# Altium schematic sheet relay isolation circuit.SchDoc
size D; SheetNumber: 2; SheetTotal: 3; SPICEModelCachePQJRNVQB: <root> / <DocumentId>PQJRNVQB</DocumentId> / </root>
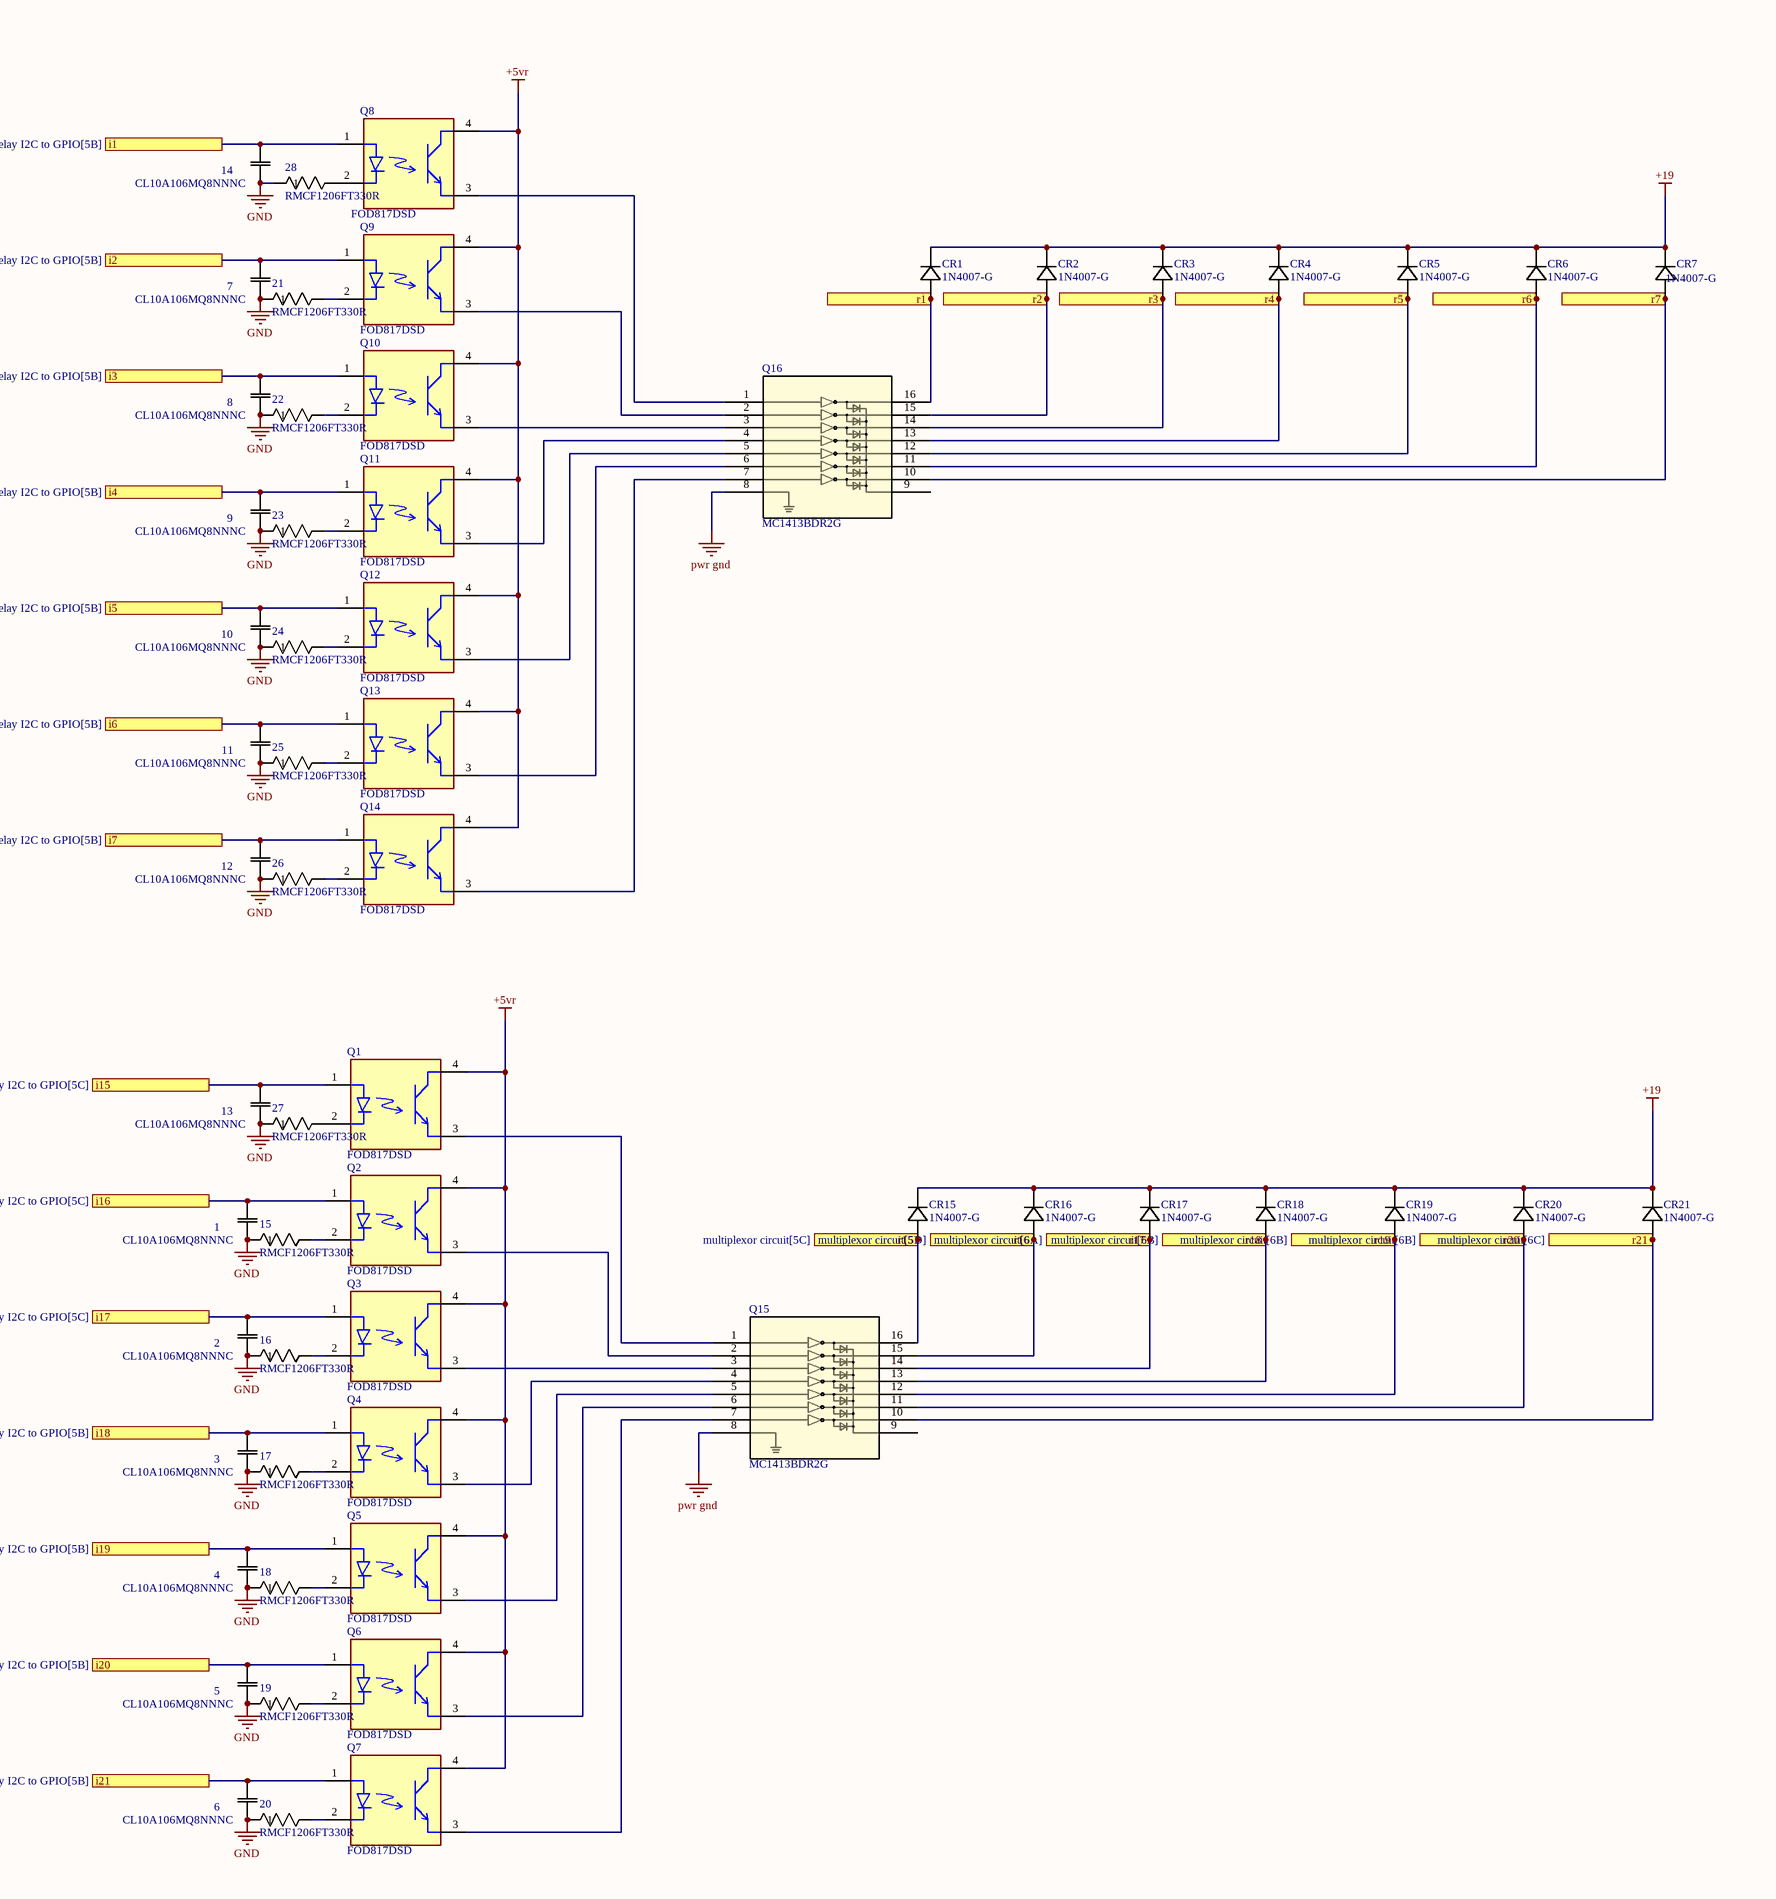
[diagram p0: relay isolation circuit.SchDoc, left]
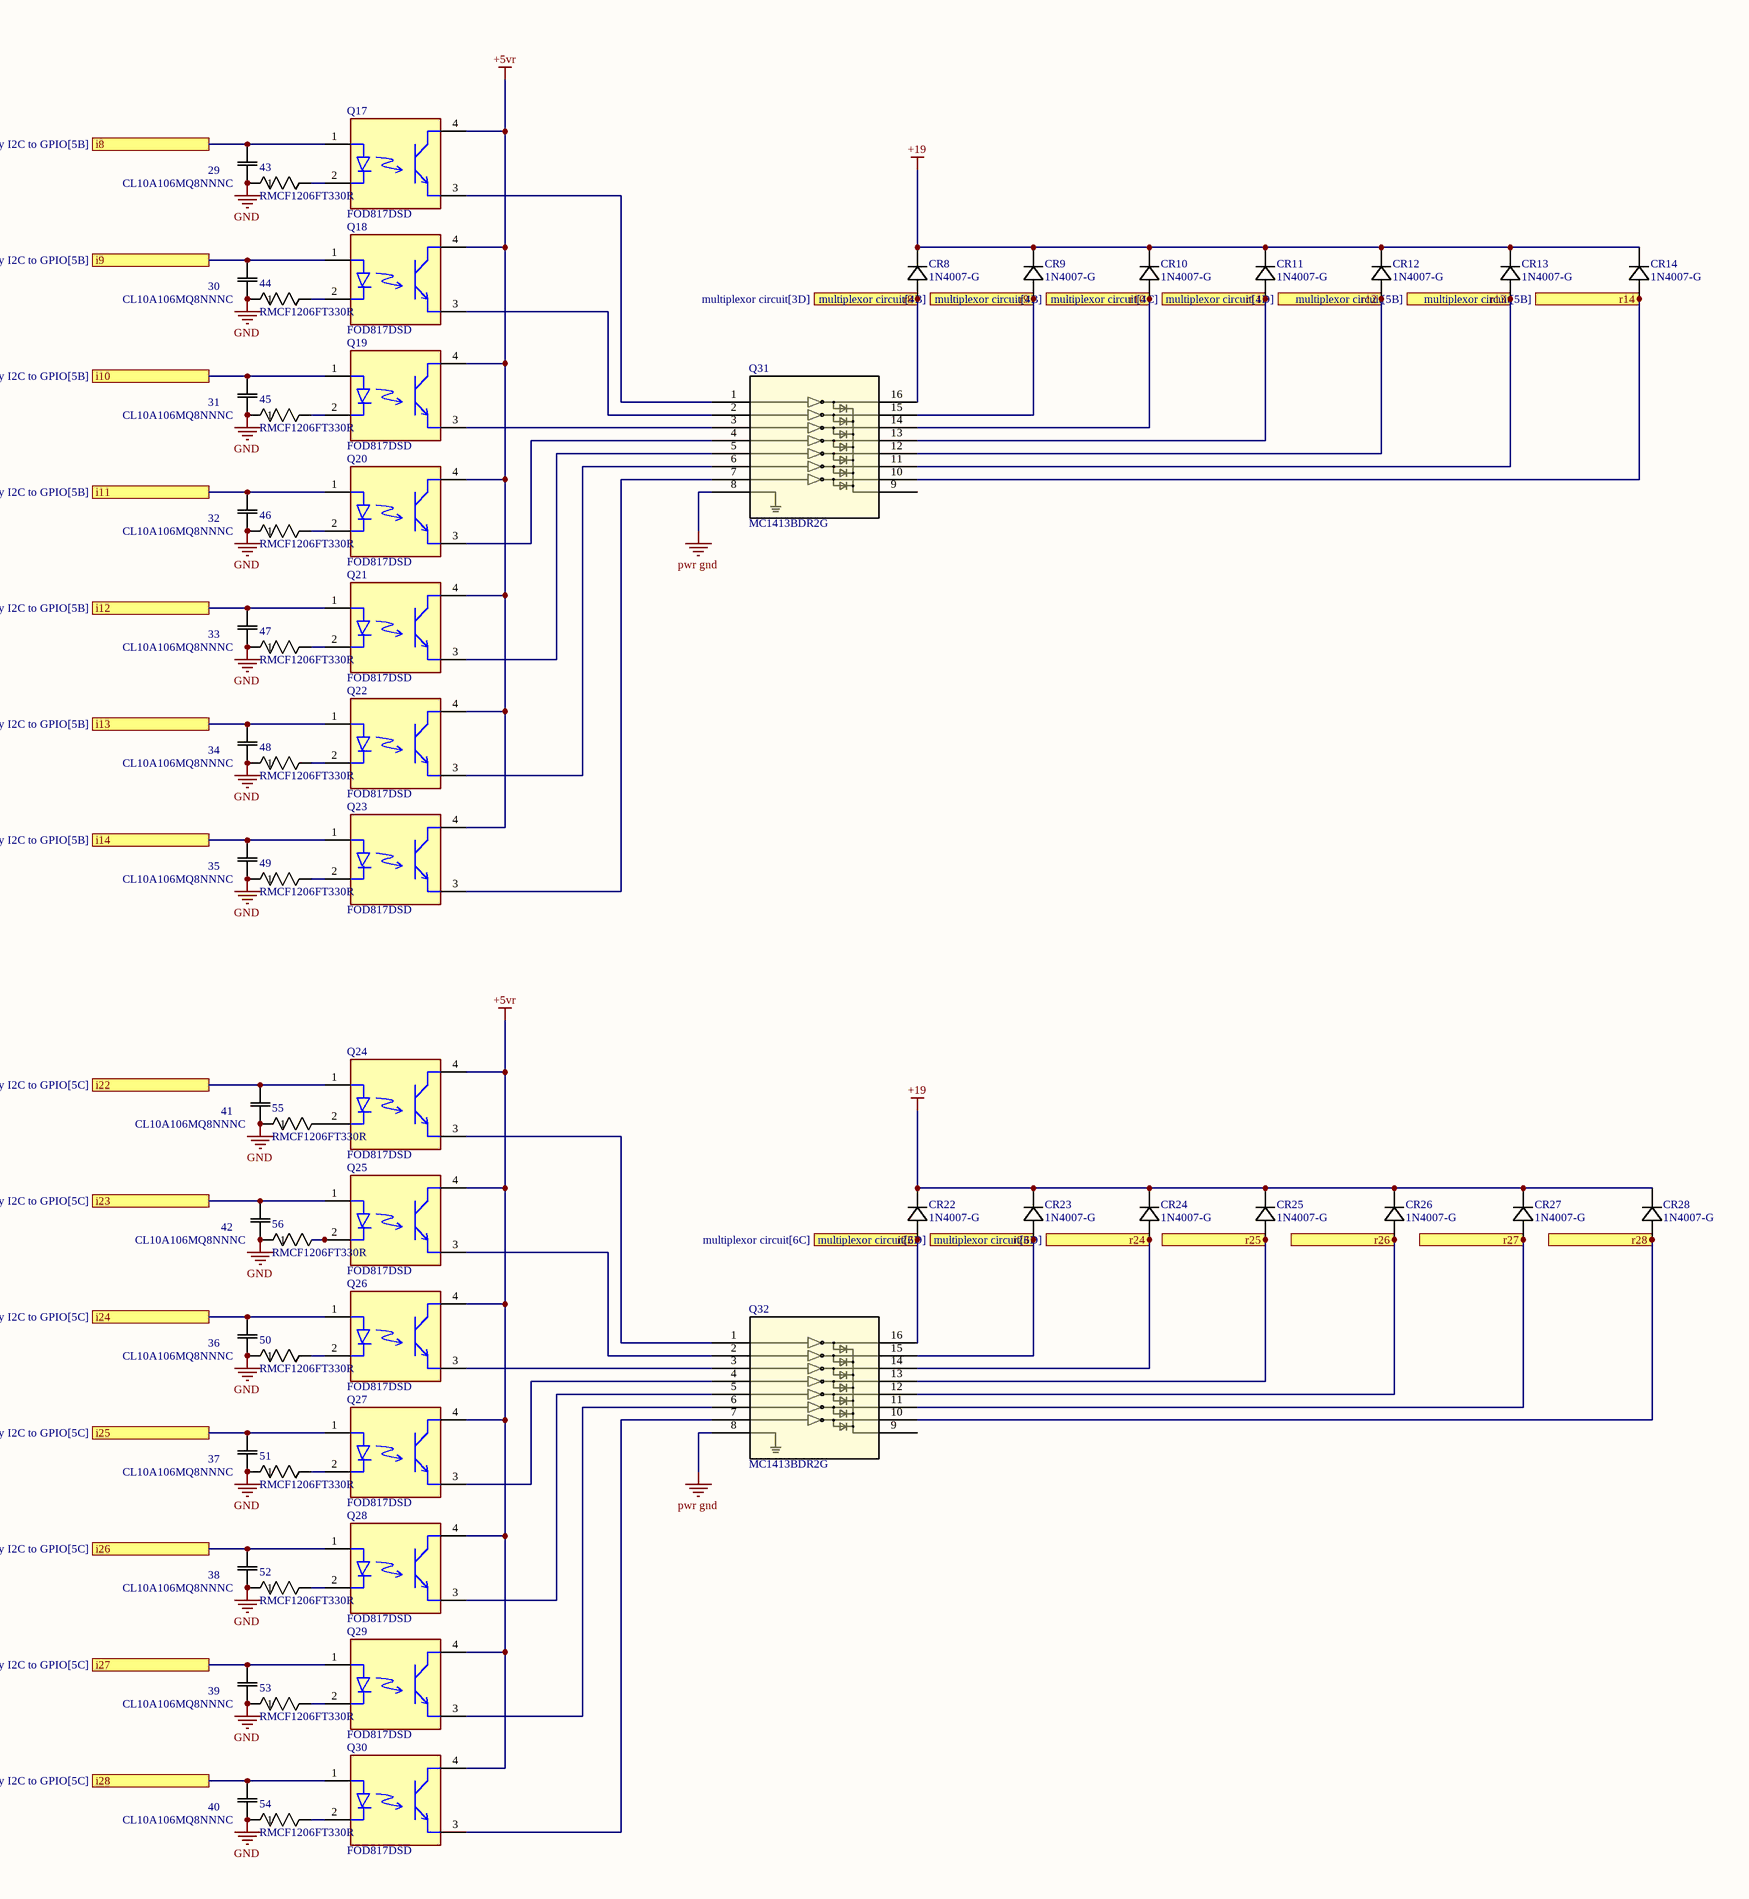
[diagram p1: relay isolation circuit.SchDoc, right]

## Parts
1  CL10A106MQ8NNNC  [CAP_CL10_SAM]
2  CL10A106MQ8NNNC  [CAP_CL10_SAM]
3  CL10A106MQ8NNNC  [CAP_CL10_SAM]
4  CL10A106MQ8NNNC  [CAP_CL10_SAM]
5  CL10A106MQ8NNNC  [CAP_CL10_SAM]
6  CL10A106MQ8NNNC  [CAP_CL10_SAM]
7  CL10A106MQ8NNNC  [CAP_CL10_SAM]
8  CL10A106MQ8NNNC  [CAP_CL10_SAM]
9  CL10A106MQ8NNNC  [CAP_CL10_SAM]
10  CL10A106MQ8NNNC  [CAP_CL10_SAM]
11  CL10A106MQ8NNNC  [CAP_CL10_SAM]
12  CL10A106MQ8NNNC  [CAP_CL10_SAM]
13  CL10A106MQ8NNNC  [CAP_CL10_SAM]
14  CL10A106MQ8NNNC  [CAP_CL10_SAM]
15  RMCF1206FT330R  [STA_RMCF1206_STP]
16  RMCF1206FT330R  [STA_RMCF1206_STP]
17  RMCF1206FT330R  [STA_RMCF1206_STP]
18  RMCF1206FT330R  [STA_RMCF1206_STP]
19  RMCF1206FT330R  [STA_RMCF1206_STP]
20  RMCF1206FT330R  [STA_RMCF1206_STP]
21  RMCF1206FT330R  [STA_RMCF1206_STP]
22  RMCF1206FT330R  [STA_RMCF1206_STP]
23  RMCF1206FT330R  [STA_RMCF1206_STP]
24  RMCF1206FT330R  [STA_RMCF1206_STP]
25  RMCF1206FT330R  [STA_RMCF1206_STP]
26  RMCF1206FT330R  [STA_RMCF1206_STP]
27  RMCF1206FT330R  [STA_RMCF1206_STP]
28  RMCF1206FT330R  [STA_RMCF1206_STP]
29  CL10A106MQ8NNNC  [CAP_CL10_SAM]
30  CL10A106MQ8NNNC  [CAP_CL10_SAM]
31  CL10A106MQ8NNNC  [CAP_CL10_SAM]
32  CL10A106MQ8NNNC  [CAP_CL10_SAM]
33  CL10A106MQ8NNNC  [CAP_CL10_SAM]
34  CL10A106MQ8NNNC  [CAP_CL10_SAM]
35  CL10A106MQ8NNNC  [CAP_CL10_SAM]
36  CL10A106MQ8NNNC  [CAP_CL10_SAM]
37  CL10A106MQ8NNNC  [CAP_CL10_SAM]
38  CL10A106MQ8NNNC  [CAP_CL10_SAM]
39  CL10A106MQ8NNNC  [CAP_CL10_SAM]
40  CL10A106MQ8NNNC  [CAP_CL10_SAM]
41  CL10A106MQ8NNNC  [CAP_CL10_SAM]
42  CL10A106MQ8NNNC  [CAP_CL10_SAM]
43  RMCF1206FT330R  [STA_RMCF1206_STP]
44  RMCF1206FT330R  [STA_RMCF1206_STP]
45  RMCF1206FT330R  [STA_RMCF1206_STP]
46  RMCF1206FT330R  [STA_RMCF1206_STP]
47  RMCF1206FT330R  [STA_RMCF1206_STP]
48  RMCF1206FT330R  [STA_RMCF1206_STP]
49  RMCF1206FT330R  [STA_RMCF1206_STP]
50  RMCF1206FT330R  [STA_RMCF1206_STP]
51  RMCF1206FT330R  [STA_RMCF1206_STP]
52  RMCF1206FT330R  [STA_RMCF1206_STP]
53  RMCF1206FT330R  [STA_RMCF1206_STP]
54  RMCF1206FT330R  [STA_RMCF1206_STP]
55  RMCF1206FT330R  [STA_RMCF1206_STP]
56  RMCF1206FT330R  [STA_RMCF1206_STP]
CR1  1N4007-G  [1N4-G]
CR2  1N4007-G  [1N4-G]
CR3  1N4007-G  [1N4-G]
CR4  1N4007-G  [1N4-G]
CR5  1N4007-G  [1N4-G]
CR6  1N4007-G  [1N4-G]
CR7  1N4007-G  [1N4-G]
CR8  1N4007-G  [1N4-G]
CR9  1N4007-G  [1N4-G]
CR10  1N4007-G  [1N4-G]
CR11  1N4007-G  [1N4-G]
CR12  1N4007-G  [1N4-G]
CR13  1N4007-G  [1N4-G]
CR14  1N4007-G  [1N4-G]
CR15  1N4007-G  [1N4-G]
CR16  1N4007-G  [1N4-G]
CR17  1N4007-G  [1N4-G]
CR18  1N4007-G  [1N4-G]
CR19  1N4007-G  [1N4-G]
CR20  1N4007-G  [1N4-G]
CR21  1N4007-G  [1N4-G]
CR22  1N4007-G  [1N4-G]
CR23  1N4007-G  [1N4-G]
CR24  1N4007-G  [1N4-G]
CR25  1N4007-G  [1N4-G]
CR26  1N4007-G  [1N4-G]
CR27  1N4007-G  [1N4-G]
CR28  1N4007-G  [1N4-G]
Q1  FOD817DSD  [FP-709AH-MFG]
Q2  FOD817DSD  [FP-709AH-MFG]
Q3  FOD817DSD  [FP-709AH-MFG]
Q4  FOD817DSD  [FP-709AH-MFG]
Q5  FOD817DSD  [FP-709AH-MFG]
Q6  FOD817DSD  [FP-709AH-MFG]
Q7  FOD817DSD  [FP-709AH-MFG]
Q8  FOD817DSD  [FP-709AH-MFG]
Q9  FOD817DSD  [FP-709AH-MFG]
Q10  FOD817DSD  [FP-709AH-MFG]
Q11  FOD817DSD  [FP-709AH-MFG]
Q12  FOD817DSD  [FP-709AH-MFG]
Q13  FOD817DSD  [FP-709AH-MFG]
Q14  FOD817DSD  [FP-709AH-MFG]
Q15  MC1413BDR2G  [SOIC16_751B-05_ONS]
Q16  MC1413BDR2G  [SOIC16_751B-05_ONS]
Q17  FOD817DSD  [FP-709AH-MFG]
Q18  FOD817DSD  [FP-709AH-MFG]
Q19  FOD817DSD  [FP-709AH-MFG]
Q20  FOD817DSD  [FP-709AH-MFG]
Q21  FOD817DSD  [FP-709AH-MFG]
Q22  FOD817DSD  [FP-709AH-MFG]
Q23  FOD817DSD  [FP-709AH-MFG]
Q24  FOD817DSD  [FP-709AH-MFG]
Q25  FOD817DSD  [FP-709AH-MFG]
Q26  FOD817DSD  [FP-709AH-MFG]
Q27  FOD817DSD  [FP-709AH-MFG]
Q28  FOD817DSD  [FP-709AH-MFG]
Q29  FOD817DSD  [FP-709AH-MFG]
Q30  FOD817DSD  [FP-709AH-MFG]
Q31  MC1413BDR2G  [SOIC16_751B-05_ONS]
Q32  MC1413BDR2G  [SOIC16_751B-05_ONS]

## Ports
i1 (see Relay I2C to GPIO[5B]), i2 (see Relay I2C to GPIO[5B]), i3 (see Relay I2C to GPIO[5B]), i4 (see Relay I2C to GPIO[5B]), i5 (see Relay I2C to GPIO[5B]), i6 (see Relay I2C to GPIO[5B]), i7 (see Relay I2C to GPIO[5B]), i8 (see Relay I2C to GPIO[5B]), i9 (see Relay I2C to GPIO[5B]), i10 (see Relay I2C to GPIO[5B]), i11 (see Relay I2C to GPIO[5B]), i12 (see Relay I2C to GPIO[5B]), i13 (see Relay I2C to GPIO[5B]), i14 (see Relay I2C to GPIO[5B]), i15 (see Relay I2C to GPIO[5C]), i16 (see Relay I2C to GPIO[5C]), i17 (see Relay I2C to GPIO[5C]), i18 (see Relay I2C to GPIO[5B]), i19 (see Relay I2C to GPIO[5B]), i20 (see Relay I2C to GPIO[5B]), i21 (see Relay I2C to GPIO[5B]), i22 (see Relay I2C to GPIO[5C]), i23 (see Relay I2C to GPIO[5C]), i24 (see Relay I2C to GPIO[5C]), i25 (see Relay I2C to GPIO[5C]), i26 (see Relay I2C to GPIO[5C]), i27 (see Relay I2C to GPIO[5C]), i28 (see Relay I2C to GPIO[5C]), r1 (see multiplexor circuit[3B]), r2 (see multiplexor circuit[3B]), r3 (see multiplexor circuit[3C]), r4 (see multiplexor circuit[3D]), r5 (see multiplexor circuit[3B]), r6 (see multiplexor circuit[3C]), r7 (see multiplexor circuit[3C]), r8 (see multiplexor circuit[3D]), r9 (see multiplexor circuit[4B]), r10 (see multiplexor circuit[4B]), r11 (see multiplexor circuit[4C]), r12 (see multiplexor circuit[4D]), r13 (see multiplexor circuit[5B]), r14 (see multiplexor circuit[5B]), r15 (see multiplexor circuit[5C]), r16 (see multiplexor circuit[5D]), r17 (see multiplexor circuit[6A]), r18 (see multiplexor circuit[6B]), r19 (see multiplexor circuit[6B]), r20 (see multiplexor circuit[6B]), r21 (see multiplexor circuit[6C]), r22 (see multiplexor circuit[6C]), r23 (see multiplexor circuit[6D]), r24 (see multiplexor circuit[6D]), r25, r26, r27, r28

## Nets
+5vr: Q1.4(C) Q2.4(C) Q3.4(C) Q4.4(C) Q5.4(C) Q6.4(C) Q7.4(C) Q8.4(C) Q9.4(C) Q10.4(C) Q11.4(C) Q12.4(C) Q13.4(C) Q14.4(C) Q17.4(C) Q18.4(C) Q19.4(C) Q20.4(C) Q21.4(C) Q22.4(C) Q23.4(C) Q24.4(C) Q25.4(C) Q26.4(C) Q27.4(C) Q28.4(C) Q29.4(C) Q30.4(C)
+19: CR1.1 CR2.1 CR3.1 CR4.1 CR5.1 CR6.1 CR7.1 CR8.1 CR9.1 CR10.1 CR11.1 CR12.1 CR13.1 CR14.1 CR15.1 CR16.1 CR17.1 CR18.1 CR19.1 CR20.1 CR21.1 CR22.1 CR23.1 CR24.1 CR25.1 CR26.1 CR27.1 CR28.1
GND: 1.1 2.1 3.1 4.1 5.1 6.1 7.1 8.1 9.1 10.1 11.1 12.1 13.1 14.1 15.1 16.1 17.1 18.1 19.1 20.1 21.1 22.1 23.1 24.1 25.1 26.1 27.1 28.1 29.1 30.1 31.1 32.1 33.1 34.1 35.1 36.1 37.1 38.1 39.1 40.1 41.1 42.1 43.1 44.1 45.1 46.1 47.1 48.1 49.1 50.1 51.1 52.1 53.1 54.1 55.1 56.1
pwr gnd: Q15.8 Q16.8 Q31.8 Q32.8
i1: 14.2 Q8.1(A) ; port i1
i2: 7.2 Q9.1(A) ; port i2
i3: 8.2 Q10.1(A) ; port i3
i4: 9.2 Q11.1(A) ; port i4
i5: 10.2 Q12.1(A) ; port i5
i6: 11.2 Q13.1(A) ; port i6
i7: 12.2 Q14.1(A) ; port i7
i8: 29.2 Q17.1(A) ; port i8
i9: 30.2 Q18.1(A) ; port i9
i10: 31.2 Q19.1(A) ; port i10
i11: 32.2 Q20.1(A) ; port i11
i12: 33.2 Q21.1(A) ; port i12
i13: 34.2 Q22.1(A) ; port i13
i14: 35.2 Q23.1(A) ; port i14
i15: 13.2 Q1.1(A) ; port i15
i16: 1.2 Q2.1(A) ; port i16
i17: 2.2 Q3.1(A) ; port i17
i18: 3.2 Q4.1(A) ; port i18
i19: 4.2 Q5.1(A) ; port i19
i20: 5.2 Q6.1(A) ; port i20
i21: 6.2 Q7.1(A) ; port i21
i22: 41.2 Q24.1(A) ; port i22
i23: 42.2 Q25.1(A) ; port i23
i24: 36.2 Q26.1(A) ; port i24
i25: 37.2 Q27.1(A) ; port i25
i26: 38.2 Q28.1(A) ; port i26
i27: 39.2 Q29.1(A) ; port i27
i28: 40.2 Q30.1(A) ; port i28
r1: CR1.2 Q16.16 ; port r1
r2: CR2.2 Q16.15 ; port r2
r3: CR3.2 Q16.14 ; port r3
r4: CR4.2 Q16.13 ; port r4
r5: CR5.2 Q16.12 ; port r5
r6: CR6.2 Q16.11 ; port r6
r7: CR7.2 Q16.10 ; port r7
r8: CR8.2 Q31.16 ; port r8
r9: CR9.2 Q31.15 ; port r9
r10: CR10.2 Q31.14 ; port r10
r11: CR11.2 Q31.13 ; port r11
r12: CR12.2 Q31.12 ; port r12
r13: CR13.2 Q31.11 ; port r13
r14: CR14.2 Q31.10 ; port r14
r15: CR15.2 Q15.16 ; port r15
r16: CR16.2 Q15.15 ; port r16
r17: CR17.2 Q15.14 ; port r17
r18: CR18.2 Q15.13 ; port r18
r19: CR19.2 Q15.12 ; port r19
r20: CR20.2 Q15.11 ; port r20
r21: CR21.2 Q15.10 ; port r21
r22: CR22.2 Q32.16 ; port r22
r23: CR23.2 Q32.15 ; port r23
r24: CR24.2 Q32.14 ; port r24
r25: CR25.2 Q32.13 ; port r25
r26: CR26.2 Q32.12 ; port r26
r27: CR27.2 Q32.11 ; port r27
r28: CR28.2 Q32.10 ; port r28
Net15_2: 15.2 Q2.2(C)
Net16_2: 16.2 Q3.2(C)
Net17_2: 17.2 Q4.2(C)
Net18_2: 18.2 Q5.2(C)
Net19_2: 19.2 Q6.2(C)
Net20_2: 20.2 Q7.2(C)
Net21_2: 21.2 Q9.2(C)
Net22_2: 22.2 Q10.2(C)
Net23_2: 23.2 Q11.2(C)
Net24_2: 24.2 Q12.2(C)
Net25_2: 25.2 Q13.2(C)
Net26_2: 26.2 Q14.2(C)
Net27_2: 27.2 Q1.2(C)
Net28_2: 28.2 Q8.2(C)
Net43_2: 43.2 Q17.2(C)
Net44_2: 44.2 Q18.2(C)
Net45_2: 45.2 Q19.2(C)
Net46_2: 46.2 Q20.2(C)
Net47_2: 47.2 Q21.2(C)
Net48_2: 48.2 Q22.2(C)
Net49_2: 49.2 Q23.2(C)
Net50_2: 50.2 Q26.2(C)
Net51_2: 51.2 Q27.2(C)
Net52_2: 52.2 Q28.2(C)
Net53_2: 53.2 Q29.2(C)
Net54_2: 54.2 Q30.2(C)
Net55_2: 55.2 Q24.2(C)
Net56_2: 56.2 Q25.2(C)
NetQ1_3: Q1.3(E) Q15.1
NetQ2_3: Q2.3(E) Q15.2
NetQ3_3: Q3.3(E) Q15.3
NetQ4_3: Q4.3(E) Q15.4
NetQ5_3: Q5.3(E) Q15.5
NetQ6_3: Q6.3(E) Q15.6
NetQ7_3: Q7.3(E) Q15.7
NetQ8_3: Q8.3(E) Q16.1
NetQ9_3: Q9.3(E) Q16.2
NetQ10_3: Q10.3(E) Q16.3
NetQ11_3: Q11.3(E) Q16.4
NetQ12_3: Q12.3(E) Q16.5
NetQ13_3: Q13.3(E) Q16.6
NetQ14_3: Q14.3(E) Q16.7
NetQ17_3: Q17.3(E) Q31.1
NetQ18_3: Q18.3(E) Q31.2
NetQ19_3: Q19.3(E) Q31.3
NetQ20_3: Q20.3(E) Q31.4
NetQ21_3: Q21.3(E) Q31.5
NetQ22_3: Q22.3(E) Q31.6
NetQ23_3: Q23.3(E) Q31.7
NetQ24_3: Q24.3(E) Q32.1
NetQ25_3: Q25.3(E) Q32.2
NetQ26_3: Q26.3(E) Q32.3
NetQ27_3: Q27.3(E) Q32.4
NetQ28_3: Q28.3(E) Q32.5
NetQ29_3: Q29.3(E) Q32.6
NetQ30_3: Q30.3(E) Q32.7

Not connected (* = marked no-connect by the designer): Q15 9; Q16 9; Q31 9; Q32 9

## Library data of the parts
1-14 29-42 = CL10A106MQ8NNNC: No Description Available; Mfr_Name: Samsung; Copyright: Copyright (C) 2022 Ultra Librarian. All rights reserved.; Manufacturer_Part_Number: CL10A106MQ8NNNC; Digi-Key_Part_Number_1: 1276-1119-2-ND; Digi-Key_Part_Number_2: 1276-1119-1-ND; Digi-Key_Part_Number_3: 1276-1119-6-ND; RefDes: RefDes; Type: DEV
15-28 43-56 = RMCF1206FT330R: No Description Available; Mfr_Name: Stackpole International; Copyright: Copyright (C) 2022 Ultra Librarian. All rights reserved.; Manufacturer_Part_Number: RMCF1206FT330R; Digi-Key_Part_Number_1: RMCF1206FT330RCT-ND; Digi-Key_Part_Number_2: RMCF1206FT330RDKR-ND; Digi-Key_Part_Number_3: RMCF1206FT330RTR-ND; RefDes: RefDes; Type: DEV
CR1-CR28 = 1N4007-G: No Description Available; Mfr_Name: Comchip; Type: DEV; Copyright: Copyright (C) 2022 Ultra Librarian. All rights reserved.; Manufacturer_Part_Number: 1N4007-G; Digi-Key_Part_Number_1: 641-1312-1-ND; Digi-Key_Part_Number_2: 641-1312-3-ND; RefDes: RefDes
Q1-Q14 Q17-Q30 = CMP-2000-06281-2: OPTOISOLATOR 5KV TRANSISTOR 4SMD; Manufacturer: ON Semiconductor; Collector Emitter Voltage: 70V; Forward Voltage: 1.2V; Isolation Voltage: 5000Vrms; Reverse Voltage: 6V; Forward Current: 50mA; Max Junction Temp: +125°C; Power Dissipation: 70mW; Standoff Height: 0.35mm; Min Current Transfer Ratio: 300%; Max Current Transfer Ratio: 600%; Lead Free: Yes; ComponentLink2URL: https://www.onsemi.cn/PowerSolutions/document/FOD814-D.PDF; RoHS: TRUE; Temperature Range Low: -55°C; Height: 3.85mm; Automotive: No; Octopart: https://octopart.com/fod817dsd-on+semiconductor-84327554; Device Class L2: Optocouplers; Emiiter Collector Voltage: 6V; Category: Trans; Device Class L1: Optoelectronics; ComponentLink2Description: Datasheet; Package: 709AH; Temperature Range High: +110°C; Temperature: -55°C to +110°C; Digikey Description: OPTOISOLATOR 5KV TRANSISTOR 4SMD; Device Class L3: unset; Mouser Description: OPTOISOLATOR 5KV TRANSISTOR 4SMD; Manufacturer Part Number: FOD817DSD; Footprint Url: https://www.onsemi.com/pub/Collateral/709AH.PDF
Q15 Q16 Q31 Q32 = MC1413BDR2G: No Description Available; Mfr_Name: onsemi; Type: DEV; Copyright: Copyright (C) 2022 Ultra Librarian. All rights reserved.; Manufacturer_Part_Number: MC1413BDR2G; Digi-Key_Part_Number_1: MC1413BDR2GOSCT-ND; Digi-Key_Part_Number_2: MC1413BDR2GOSDKR-ND; Digi-Key_Part_Number_3: MC1413BDR2GOSTR-ND; RefDes: RefDes